# EAGLE design tarjeta2 (EAGLE 6.4)
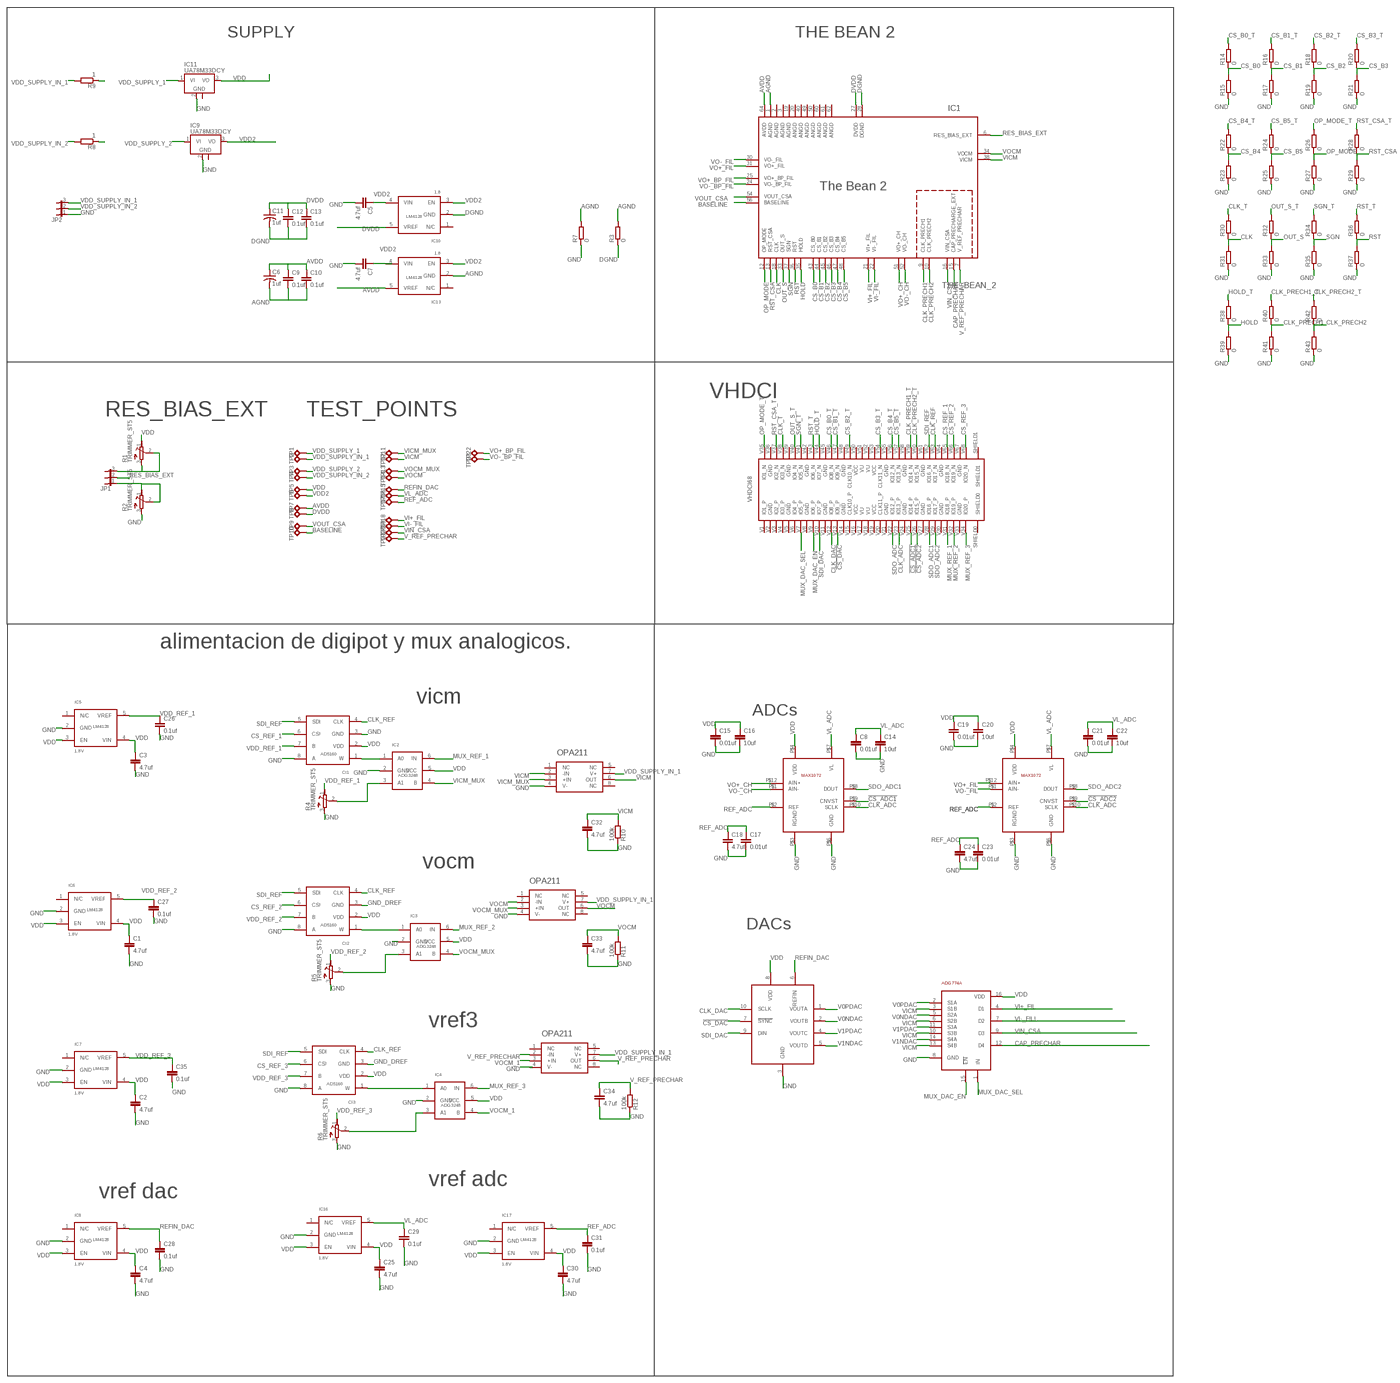
[diagram p0: schematic, sheet 1, overview]
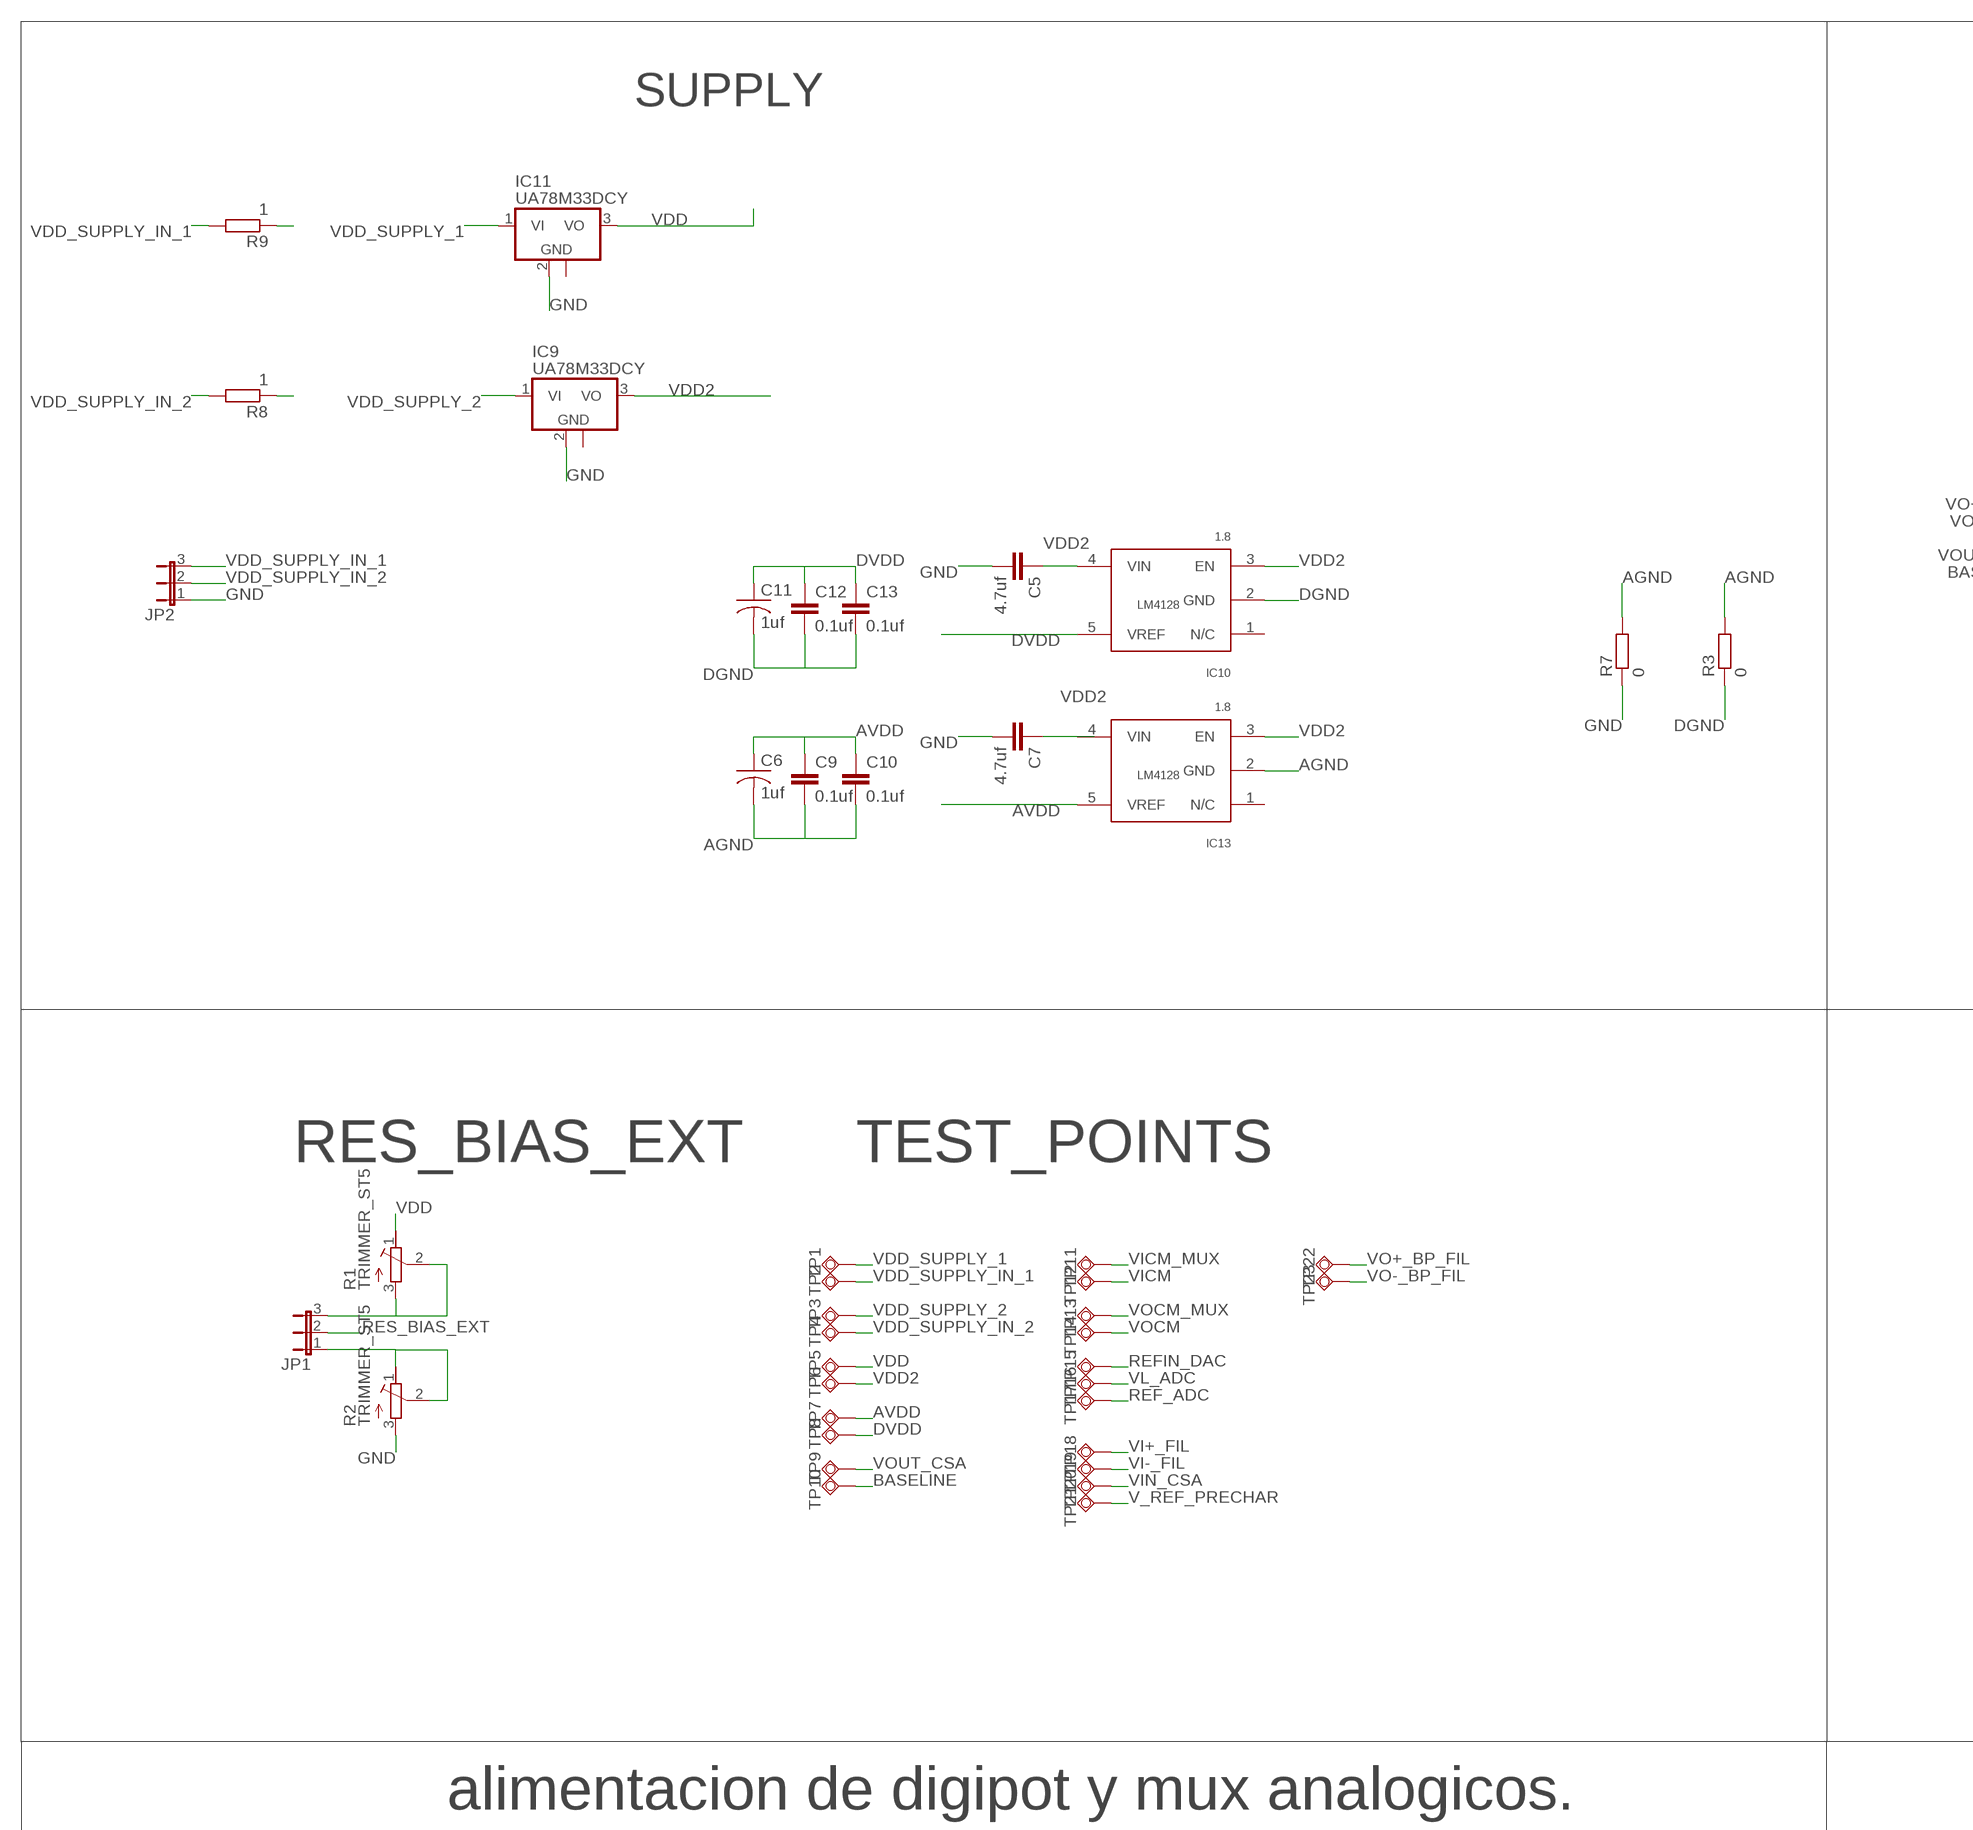
[diagram p1: schematic, sheet 1, part 1 of 4]
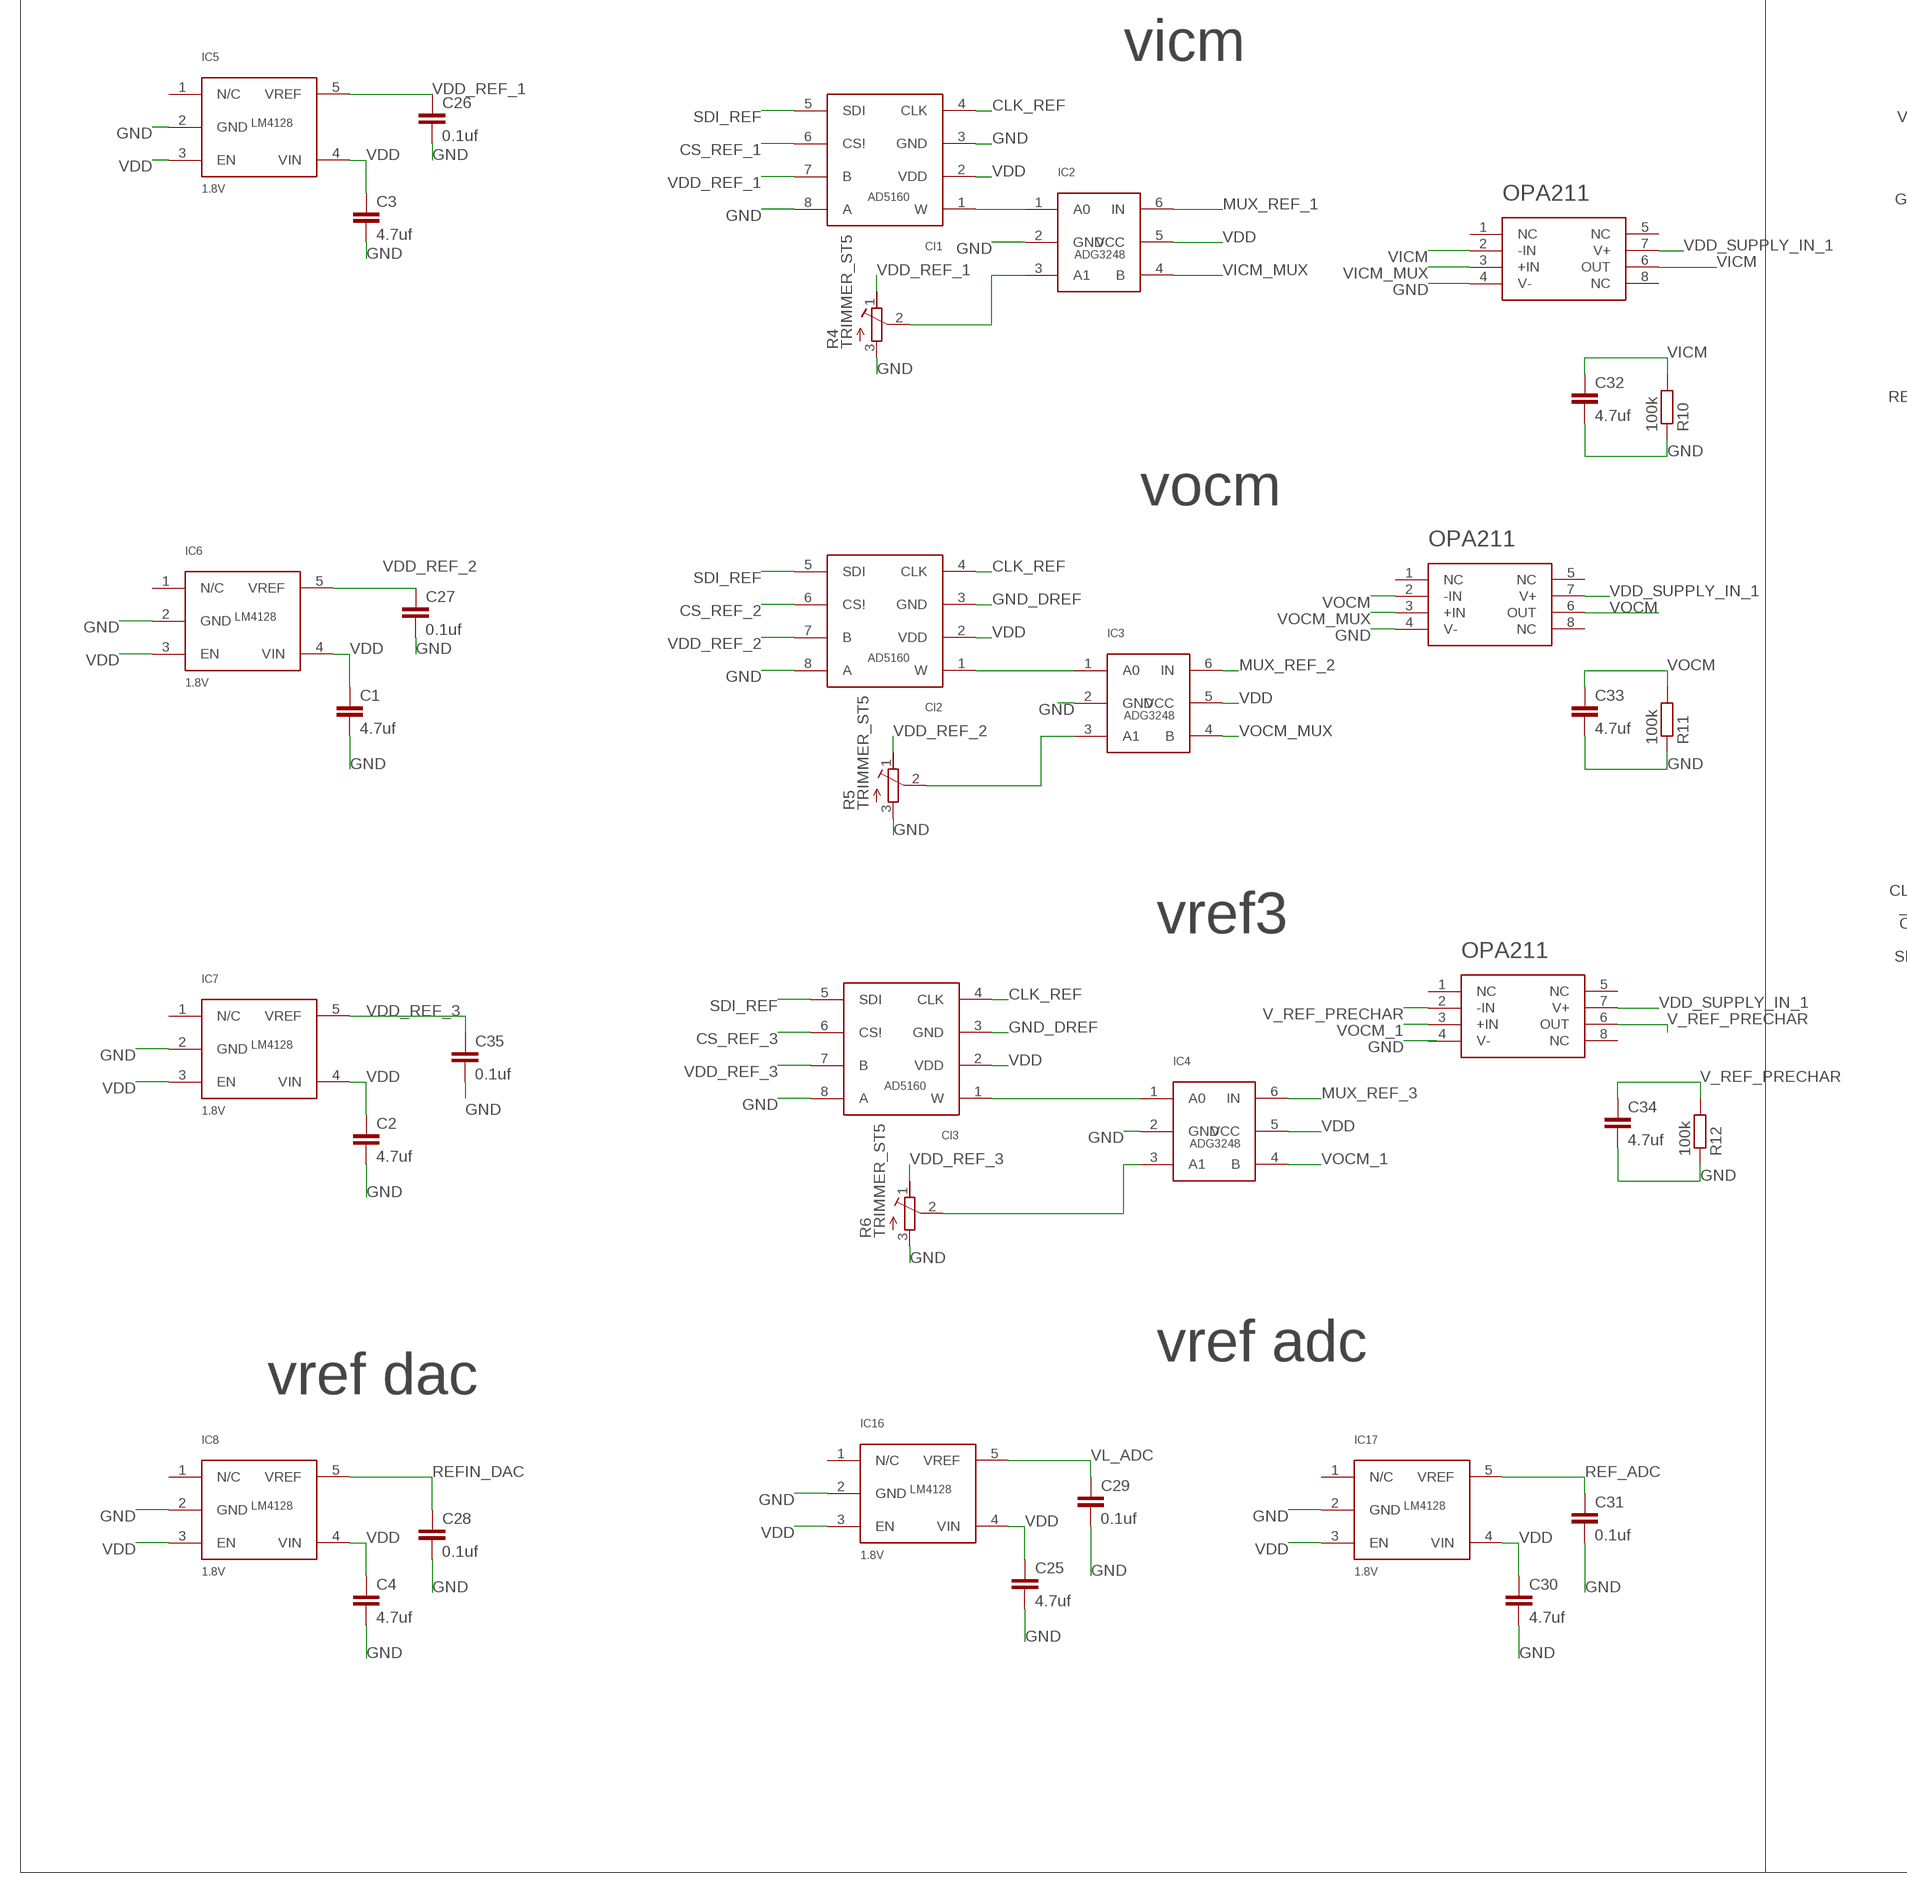
[diagram p2: schematic, sheet 1, part 2 of 4]
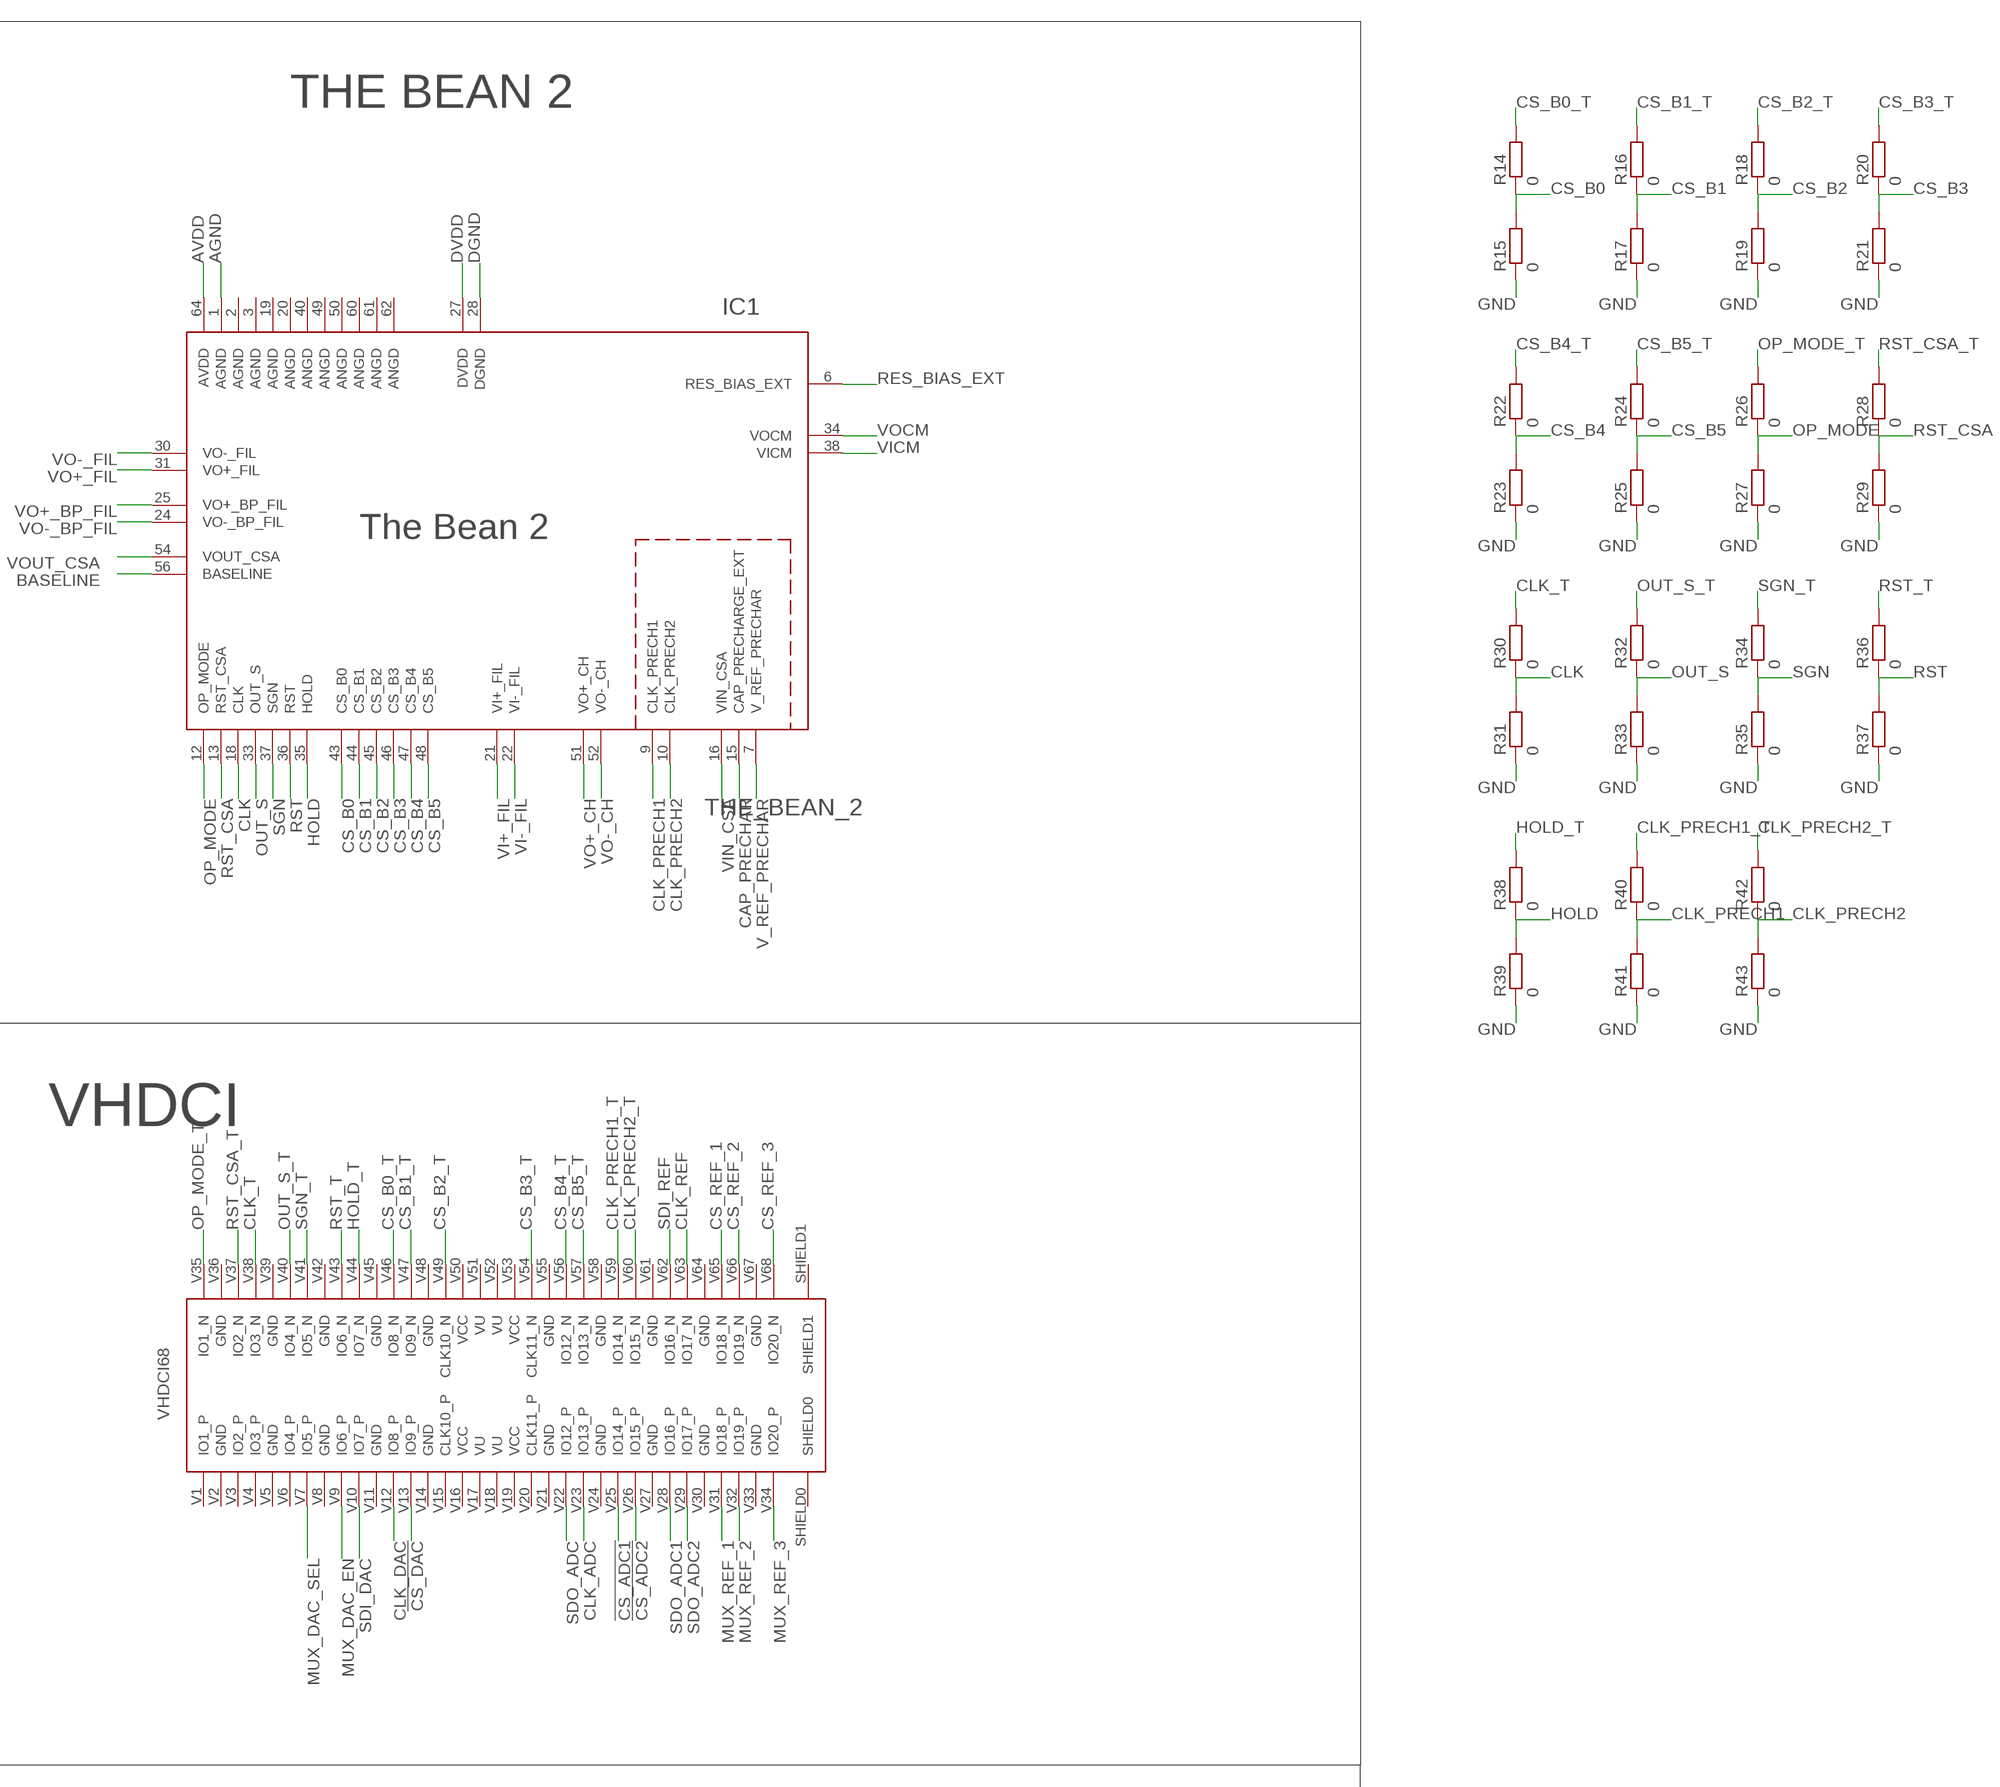
[diagram p3: schematic, sheet 1, part 3 of 4]
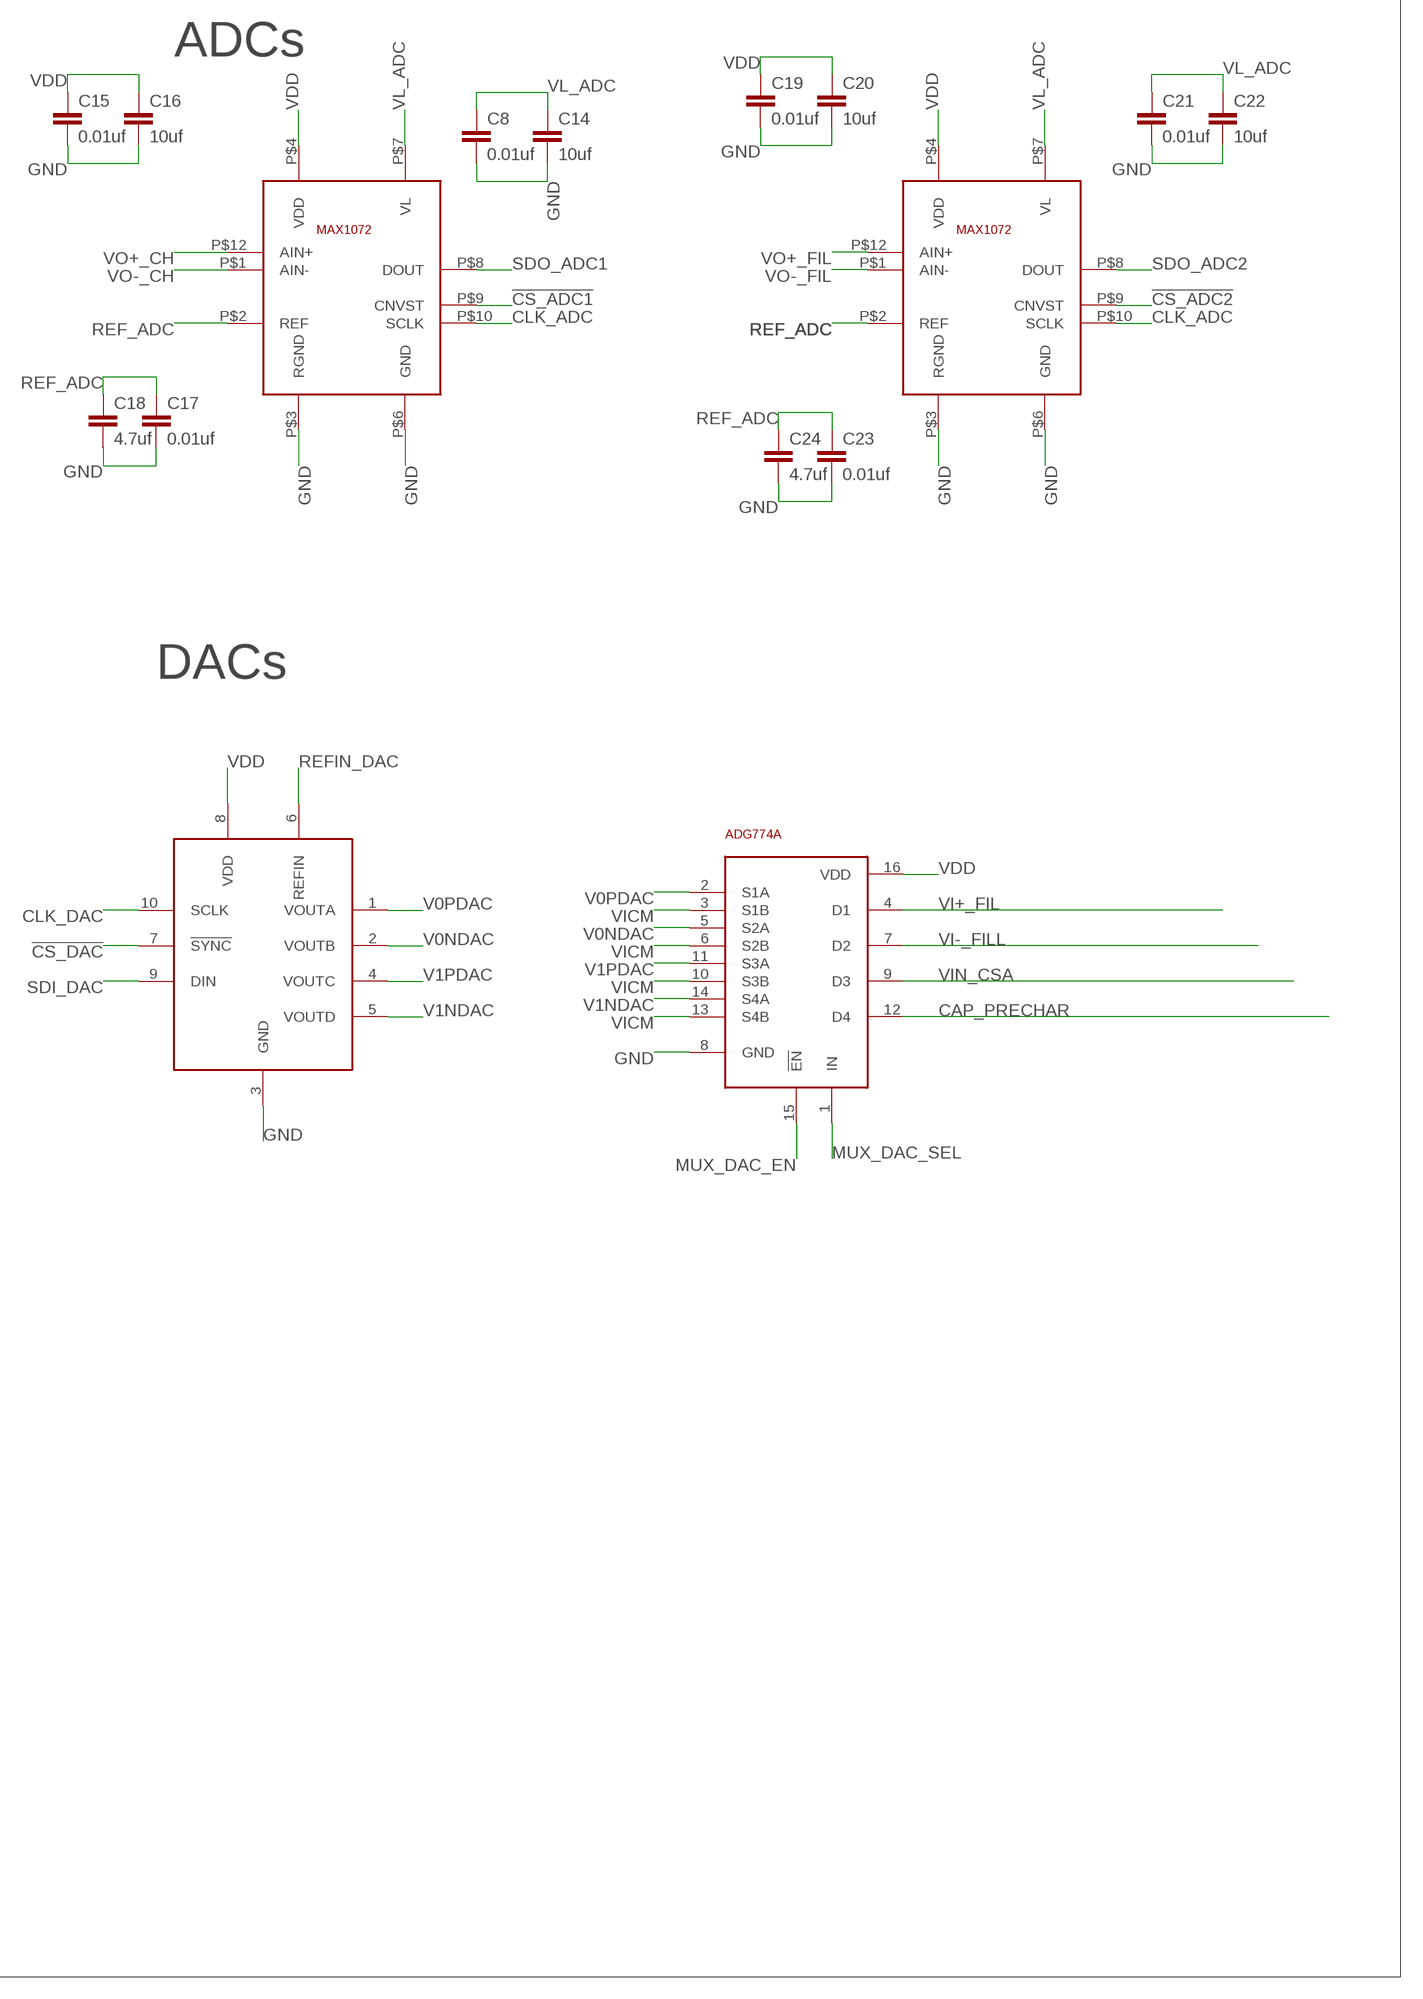
[diagram p4: schematic, sheet 1, part 4 of 4]

## Parts
C1  4.7uf  C-EUC0402  [C0402]
C2  4.7uf  C-EUC0402  [C0402]
C3  4.7uf  C-EUC0402  [C0402]
C4  4.7uf  C-EUC0402  [C0402]
C5  4.7uf  C-EUC0402  [C0402]
C6  1uf  C-USC0805  [C0805]
C7  4.7uf  C-EUC0402  [C0402]
C8  0.01uf  C-EUC0402  [C0402]
C9  0.1uf  C-EUC0402  [C0402]
C10  0.1uf  C-EUC0402  [C0402]
C11  1uf  C-USC0805  [C0805]
C12  0.1uf  C-EUC0402  [C0402]
C13  0.1uf  C-EUC0402  [C0402]
C14  10uf  C-EUC0402  [C0402]
C15  0.01uf  C-EUC0402  [C0402]
C16  10uf  C-EUC0402  [C0402]
C17  0.01uf  C-EUC0402  [C0402]
C18  4.7uf  C-EUC0402  [C0402]
C19  0.01uf  C-EUC0402  [C0402]
C20  10uf  C-EUC0402  [C0402]
C21  0.01uf  C-EUC0402  [C0402]
C22  10uf  C-EUC0402  [C0402]
C23  0.01uf  C-EUC0402  [C0402]
C24  4.7uf  C-EUC0402  [C0402]
C25  4.7uf  C-EUC0402  [C0402]
C26  0.1uf  C-EUC0402  [C0402]
C27  0.1uf  C-EUC0402  [C0402]
C28  0.1uf  C-EUC0402  [C0402]
C29  0.1uf  C-EUC0402  [C0402]
C30  4.7uf  C-EUC0402  [C0402]
C31  0.1uf  C-EUC0402  [C0402]
C32  4.7uf  C-EUC0402  [C0402]
C33  4.7uf  C-EUC0402  [C0402]
C34  4.7uf  C-EUC0402  [C0402]
C35  0.1uf  C-EUC0402  [C0402]
CI1  AD5160  [SOT23-8]
CI2  AD5160  [SOT23-8]
CI3  AD5160  [SOT23-8]
IC1  THE_BEAN_2  [QFN64]
IC2  ADG3248  [SC70]
IC3  ADG3248  [SC70]
IC4  ADG3248  [SC70]
IC5  1.8V  LM4128  [SOT23-5L]
IC6  1.8V  LM4128  [SOT23-5L]
IC7  1.8V  LM4128  [SOT23-5L]
IC8  1.8V  LM4128  [SOT23-5L]
IC9  UA78M33DCY  [SOT223]
IC10  1.8  LM4128  [SOT23-5L]
IC11  UA78M33DCY  [SOT223]
IC12  OPA211  [SOIC8]
IC13  1.8  LM4128  [SOT23-5L]
IC14  OPA211  [SOIC8]
IC15  OPA211  [SOIC8]
IC16  1.8V  LM4128  [SOT23-5L]
IC17  1.8V  LM4128  [SOT23-5L]
JP1  JP2E  [JP2]
JP2  JP2E  [JP2]
R1  TRIMMER_ST5  [ST-5EW]
R2  TRIMMER_ST5  [ST-5EW]
R3  0  R-EU_R0402  [R0402]
R4  TRIMMER_ST5  [ST-5EW]
R5  TRIMMER_ST5  [ST-5EW]
R6  TRIMMER_ST5  [ST-5EW]
R7  0  R-EU_R0402  [R0402]
R8  1  R-EU_R0402  [R0402]
R9  1  R-EU_R0402  [R0402]
R10  100k  R-EU_R0402  [R0402]
R11  100k  R-EU_R0402  [R0402]
R12  100k  R-EU_R0402  [R0402]
R14  0  R-EU_R0402  [R0402]
R15  0  R-EU_R0402  [R0402]
R16  0  R-EU_R0402  [R0402]
R17  0  R-EU_R0402  [R0402]
R18  0  R-EU_R0402  [R0402]
R19  0  R-EU_R0402  [R0402]
R20  0  R-EU_R0402  [R0402]
R21  0  R-EU_R0402  [R0402]
R22  0  R-EU_R0402  [R0402]
R23  0  R-EU_R0402  [R0402]
R24  0  R-EU_R0402  [R0402]
R25  0  R-EU_R0402  [R0402]
R26  0  R-EU_R0402  [R0402]
R27  0  R-EU_R0402  [R0402]
R28  0  R-EU_R0402  [R0402]
R29  0  R-EU_R0402  [R0402]
R30  0  R-EU_R0402  [R0402]
R31  0  R-EU_R0402  [R0402]
R32  0  R-EU_R0402  [R0402]
R33  0  R-EU_R0402  [R0402]
R34  0  R-EU_R0402  [R0402]
R35  0  R-EU_R0402  [R0402]
R36  0  R-EU_R0402  [R0402]
R37  0  R-EU_R0402  [R0402]
R38  0  R-EU_R0402  [R0402]
R39  0  R-EU_R0402  [R0402]
R40  0  R-EU_R0402  [R0402]
R41  0  R-EU_R0402  [R0402]
R42  0  R-EU_R0402  [R0402]
R43  0  R-EU_R0402  [R0402]
TP1  TEST_POINT  [TP]
TP2  TEST_POINT  [TP]
TP3  TEST_POINT  [TP]
TP4  TEST_POINT  [TP]
TP5  TEST_POINT  [TP]
TP6  TEST_POINT  [TP]
TP7  TEST_POINT  [TP]
TP8  TEST_POINT  [TP]
TP9  TEST_POINT  [TP]
TP10  TEST_POINT  [TP]
TP11  TEST_POINT  [TP]
TP12  TEST_POINT  [TP]
TP13  TEST_POINT  [TP]
TP14  TEST_POINT  [TP]
TP15  TEST_POINT  [TP]
TP16  TEST_POINT  [TP]
TP17  TEST_POINT  [TP]
TP18  TEST_POINT  [TP]
TP19  TEST_POINT  [TP]
TP20  TEST_POINT  [TP]
TP21  TEST_POINT  [TP]
TP22  TEST_POINT  [TP]
TP23  TEST_POINT  [TP]
U$1  ADG774A  [QSOP16]
U$2  VHDCI68  [VHDCI68]
U$3  MAX1072  [TQFN12]
U$4  DAC7554  [MSOP10]
U$5  MAX1072  [TQFN12]

## Nets
!CS_ADC1: U$2.V25(IO14_P) U$3.P$9(CNVST)
!CS_ADC2: U$2.V26(IO15_P) U$5.P$9(CNVST)
!CS_DAC: U$2.V13(IO9_P) U$4.7(!SYNC)
AGND: C6.2 C9.2 C10.2 IC1.1(AGND) IC13.2(GND) R3.2 R7.2
AVDD: C6.1 C9.1 C10.1 IC1.64(AVDD) IC13.5(VREF) TP7.TP
BASELINE: IC1.56(BASELINE) TP10.TP
CAP_PRECHAR: IC1.15(CAP_PRECHARGE_EXT) U$1.12(D4)
CLK: IC1.18(CLK) R30.1 R31.2
CLK_ADC: U$2.V23(IO13_P) U$3.P$10(SCLK) U$5.P$10(SCLK)
CLK_DAC: U$2.V12(IO8_P) U$4.10(SCLK)
CLK_PRECH1: IC1.9(CLK_PRECH1) R40.1 R41.2
CLK_PRECH1_T: R40.2 U$2.V59(IO14_N)
CLK_PRECH2: IC1.10(CLK_PRECH2) R42.1 R43.2
CLK_PRECH2_T: R42.2 U$2.V60(IO15_N)
CLK_REF: CI1.4(CLK) CI2.4(CLK) CI3.4(CLK) U$2.V63(IO17_N)
CLK_T: R30.2 U$2.V38(IO3_N)
CS_B0: IC1.43(CS_B0) R14.1 R15.2
CS_B0_T: R14.2 U$2.V46(IO8_N)
CS_B1: IC1.44(CS_B1) R16.1 R17.2
CS_B1_T: R16.2 U$2.V47(IO9_N)
CS_B2: IC1.45(CS_B2) R18.1 R19.2
CS_B2_T: R18.2 U$2.V49(CLK10_N)
CS_B3: IC1.46(CS_B3) R20.1 R21.2
CS_B3_T: R20.2 U$2.V54(CLK11_N)
CS_B4: IC1.47(CS_B4) R22.1 R23.2
CS_B4_T: R22.2 U$2.V56(IO12_N)
CS_B5: IC1.48(CS_B5) R24.1 R25.2
CS_B5_T: R24.2 U$2.V57(IO13_N)
CS_REF_1: CI1.6(CS!) U$2.V65(IO18_N)
CS_REF_2: CI2.6(CS!) U$2.V66(IO19_N)
CS_REF_3: CI3.6(CS!) U$2.V68(IO20_N)
DGND: C11.2 C12.2 C13.2 IC1.28(DGND) IC10.2(GND) R3.1
DVDD: C11.1 C12.1 C13.1 IC1.27(DVDD) IC10.5(VREF) TP8.TP
GND: C1.2 C2.2 C3.2 C4.2 C5.2 C7.2 C8.2 C14.2 C15.2 C16.2 C17.2 C18.2 C19.2 C20.2 C21.2 C22.2 C23.2 C24.2 C25.2 C26.2 C27.2 C28.2 C29.2 C30.2 C31.2 C32.2 C33.2 C34.2 C35.2 CI1.3(GND) CI1.8(A) CI2.8(A) CI3.8(A) IC2.2(GND) IC3.2(GND) IC4.2(GND) IC5.2(GND) IC6.2(GND) IC7.2(GND) IC8.2(GND) IC9.2(GND) IC11.2(GND) IC12.4(V-) IC16.2(GND) IC17.2(GND) JP2.1 R2.3 R4.3 R5.3 R6.3 R7.1 R10.1 R11.1 R12.1 R15.1 R17.1 R19.1 R21.1 R23.1 R25.1 R27.1 R29.1 R31.1 R33.1 R35.1 R37.1 R39.1 R41.1 R43.1 U$1.8(GND) U$3.P$3(RGND) U$3.P$6(GND) U$4.3(GND) U$5.P$3(RGND) U$5.P$6(GND)
GND_DREF: CI2.3(GND) CI3.3(GND)
HOLD: IC1.35(HOLD) R38.1 R39.2
HOLD_T: R38.2 U$2.V44(IO7_N)
MUX_DAC_EN: U$1.15(!EN) U$2.V9(IO6_P)
MUX_DAC_SEL: U$1.1(IN) U$2.V7(IO5_P)
MUX_REF_1: IC2.6(IN) U$2.V31(IO18_P)
MUX_REF_2: IC3.6(IN) U$2.V32(IO19_P)
MUX_REF_3: IC4.6(IN) U$2.V34(IO20_P)
N$1: JP1.3 R1.2 R1.3
N$2: JP1.1 R2.1 R2.2
N$5: CI3.1(W) IC4.1(A0)
N$10: IC4.3(A1) R6.2
N$17: CI1.1(W) IC2.1(A0)
N$18: IC2.3(A1) R4.2
N$19: CI2.1(W) IC3.1(A0)
N$28: IC3.3(A1) R5.2
OP_MODE: IC1.12(OP_MODE) R26.1 R27.2
OP_MODE_T: R26.2 U$2.V35(IO1_N)
OUT_S: IC1.33(OUT_S) R32.1 R33.2
OUT_S_T: R32.2 U$2.V40(IO4_N)
REF_ADC: C17.1 C18.1 C23.1 C24.1 C31.1 IC17.5(VREF) TP17.TP U$3.P$2(REF) U$5.P$2(REF)
REFIN_DAC: IC8.5(VREF) TP15.TP U$4.6(REFIN)
RES_BIAS_EXT: IC1.6(RES_BIAS_EXT) JP1.2
RST: IC1.36(RST) R36.1 R37.2
RST_CSA: IC1.13(RST_CSA) R28.1 R29.2
RST_CSA_T: R28.2 U$2.V37(IO2_N)
RST_T: R36.2 U$2.V43(IO6_N)
SDI_DAC: U$2.V10(IO7_P) U$4.9(DIN)
SDI_REF: CI1.5(SDI) CI2.5(SDI) CI3.5(SDI) U$2.V62(IO16_N)
SDO_ADC: U$2.V22(IO12_P)
SDO_ADC1: U$2.V28(IO16_P) U$3.P$8(DOUT)
SDO_ADC2: U$2.V29(IO17_P) U$5.P$8(DOUT)
SGN: IC1.37(SGN) R34.1 R35.2
SGN_T: R34.2 U$2.V41(IO5_N)
V0NDAC: U$1.5(S2A) U$4.2(VOUTB)
V0PDAC: U$1.2(S1A) U$4.1(VOUTA)
V1NDAC: U$1.14(S4A) U$4.5(VOUTD)
V1PDAC: U$1.11(S3A) U$4.4(VOUTC)
V_REF_PRECHAR: C34.1 IC1.7(V_REF_PRECHAR) IC15.2(-IN) IC15.6(OUT) R12.2 TP21.TP
VDD: C1.1 C2.1 C3.1 C4.1 C15.1 C16.1 C19.1 C20.1 C25.1 C30.1 CI1.2(VDD) CI2.2(VDD) CI3.2(VDD) IC2.5(VCC) IC3.5(VCC) IC4.5(VCC) IC5.3(EN) IC5.4(VIN) IC6.3(EN) IC6.4(VIN) IC7.3(EN) IC7.4(VIN) IC8.3(EN) IC8.4(VIN) IC11.3(VO) IC16.3(EN) IC16.4(VIN) IC17.3(EN) IC17.4(VIN) R1.1 TP5.TP U$1.16(VDD) U$3.P$4(VDD) U$4.8(VDD) U$5.P$4(VDD)
VDD1: C28.1
VDD2: C5.1 C7.1 IC9.3(VO) IC10.3(EN) IC10.4(VIN) IC13.3(EN) IC13.4(VIN) TP6.TP
VDD_REF_1: C26.1 CI1.7(B) IC5.5(VREF) R4.1
VDD_REF_2: C27.1 CI2.7(B) IC6.5(VREF) R5.1
VDD_REF_3: C35.1 CI3.7(B) IC7.5(VREF) R6.1
VDD_SUPPLY_1: IC11.1(VI) R9.1 TP1.TP
VDD_SUPPLY_2: IC9.1(VI) R8.1 TP3.TP
VDD_SUPPLY_IN_1: IC12.7(V+) IC14.7(V+) IC15.7(V+) JP2.3 R9.2 TP2.TP
VDD_SUPPLY_IN_2: JP2.2 R8.2 TP4.TP
VI+_FIL: IC1.21(VI+_FIL) TP18.TP U$1.4(D1)
VI-_FIL: IC1.22(VI-_FIL) TP19.TP
VI-_FILL: U$1.7(D2)
VICM: C32.1 IC1.38(VICM) IC12.2(-IN) IC12.6(OUT) R10.2 TP12.TP U$1.3(S1B) U$1.6(S2B) U$1.10(S3B) U$1.13(S4B)
VICM_MUX: IC2.4(B) IC12.3(+IN) TP11.TP
VIN_CSA: IC1.16(VIN_CSA) TP20.TP U$1.9(D3)
VL_ADC: C8.1 C14.1 C21.1 C22.1 C29.1 IC16.5(VREF) TP16.TP U$3.P$7(VL) U$5.P$7(VL)
VO+_BP_FIL: IC1.25(VO+_BP_FIL) TP22.TP
VO+_CH: IC1.51(VO+_CH) U$3.P$12(AIN+)
VO+_FIL: IC1.31(VO+_FIL) U$5.P$12(AIN+)
VO-_BP_FIL: IC1.24(VO-_BP_FIL) TP23.TP
VO-_CH: IC1.52(VO-_CH) U$3.P$1(AIN-)
VO-_FIL: IC1.30(VO-_FIL) U$5.P$1(AIN-)
VOCM: C33.1 IC1.34(VOCM) IC14.2(-IN) IC14.6(OUT) R11.2 TP14.TP
VOCM_1: IC4.4(B) IC15.3(+IN)
VOCM_MUX: IC3.4(B) IC14.3(+IN) TP13.TP
VOUT_CSA: IC1.54(VOUT_CSA) TP9.TP
Unconnected: IC5.1(N/C) IC6.1(N/C) IC7.1(N/C) IC8.1(N/C) IC9.4(GND) IC10.1(N/C) IC11.4(GND) IC12.1(NC) IC12.5(NC) IC12.8(NC) IC13.1(N/C) IC14.1(NC) IC14.4(V-) IC14.5(NC) IC14.8(NC) IC15.1(NC) IC15.4(V-) IC15.5(NC) IC15.8(NC) IC16.1(N/C) IC17.1(N/C) U$2.SHIELD0 U$2.SHIELD1 U$2.V1(IO1_P) U$2.V2(GND) U$2.V3(IO2_P) U$2.V4(IO3_P) U$2.V5(GND) U$2.V6(IO4_P) U$2.V8(GND) U$2.V11(GND) U$2.V14(GND) U$2.V15(CLK10_P) U$2.V20(CLK11_P) U$2.V21(GND) U$2.V24(GND) U$2.V27(GND) U$2.V30(GND) U$2.V33(GND) U$2.V36(GND) U$2.V39(GND) U$2.V42(GND) U$2.V45(GND) U$2.V48(GND) U$2.V55(GND) U$2.V58(GND) U$2.V61(GND) U$2.V64(GND) U$2.V67(GND)

## Notes on the sheet
- SUPPLY | THE BEAN 2
- VHDCI
- RES_BIAS_EXT | TEST_POINTS
- alimentacion de digipot y mux analogicos.
- vicm
- ADCs
- vocm
- DACs
- vref3
- vref adc
- vref dac

## Power pins joined to a net without a drawn wire
AGND: IC1.2(AGND) IC1.3(AGND) IC1.19(AGND)
ANGD: IC1.20(ANGD) IC1.40(ANGD) IC1.49(ANGD) IC1.50(ANGD) IC1.60(ANGD) IC1.61(ANGD) IC1.62(ANGD)
VCC: U$2.V16(VCC) U$2.V19(VCC) U$2.V50(VCC) U$2.V53(VCC)
VU: U$2.V17(VU) U$2.V18(VU) U$2.V51(VU) U$2.V52(VU)

## Library data of the parts
C1-C5 C7-C10 C12-C35 = rcl:C-EU: CAPACITOR, European symbol
C6 C11 = rcl:C-US: CAPACITOR, American symbol
CI1-CI3 = wac:AD5160: Digital potenciometer, package SOT23-8
IC1 = wac:THE_BEAN_2
IC2-IC4 = wac:ADG3248
IC5-IC8 IC10 IC13 IC16 IC17 = wac:LM4128
IC9 IC11 = linear:UA78M*: POSITIVE-VOLTAGE REGULATORS Source: http://focus.ti.com/lit/ds/symlink/ua78m33.pdf
IC12 IC14 IC15 = wac:OPA211
JP1 JP2 = jumper:JP2E: JUMPER
R1 R2 R4-R6 = wac:TRIMMER_ST5
R3 R7-R12 R14-R43 = rcl:R-EU_: RESISTOR, European symbol
TP1-TP23 = wac:TEST_POINT
U$1 = wac:ADG774A: Low voltage,400MHz, Quad 2:1 MUX with 3ns Switching Time http://www.analog.com/static/imported-files/data_sheets/ADG774A.pdf
U$2 = tw:VHDCI68: Nexys 3 VHDCI 68pin 0.8mm pitch
U$3 U$5 = wac:MAX1072
U$4 = wac:DAC7554: 12-BIT, QUAD, ULTRALOW GLITCH, VOLTAGE OUTPUT DIGITAL-TO-ANALOG CONVERTER http://www.ti.com/lit/ds/symlink/dac7554.pdf

## Board
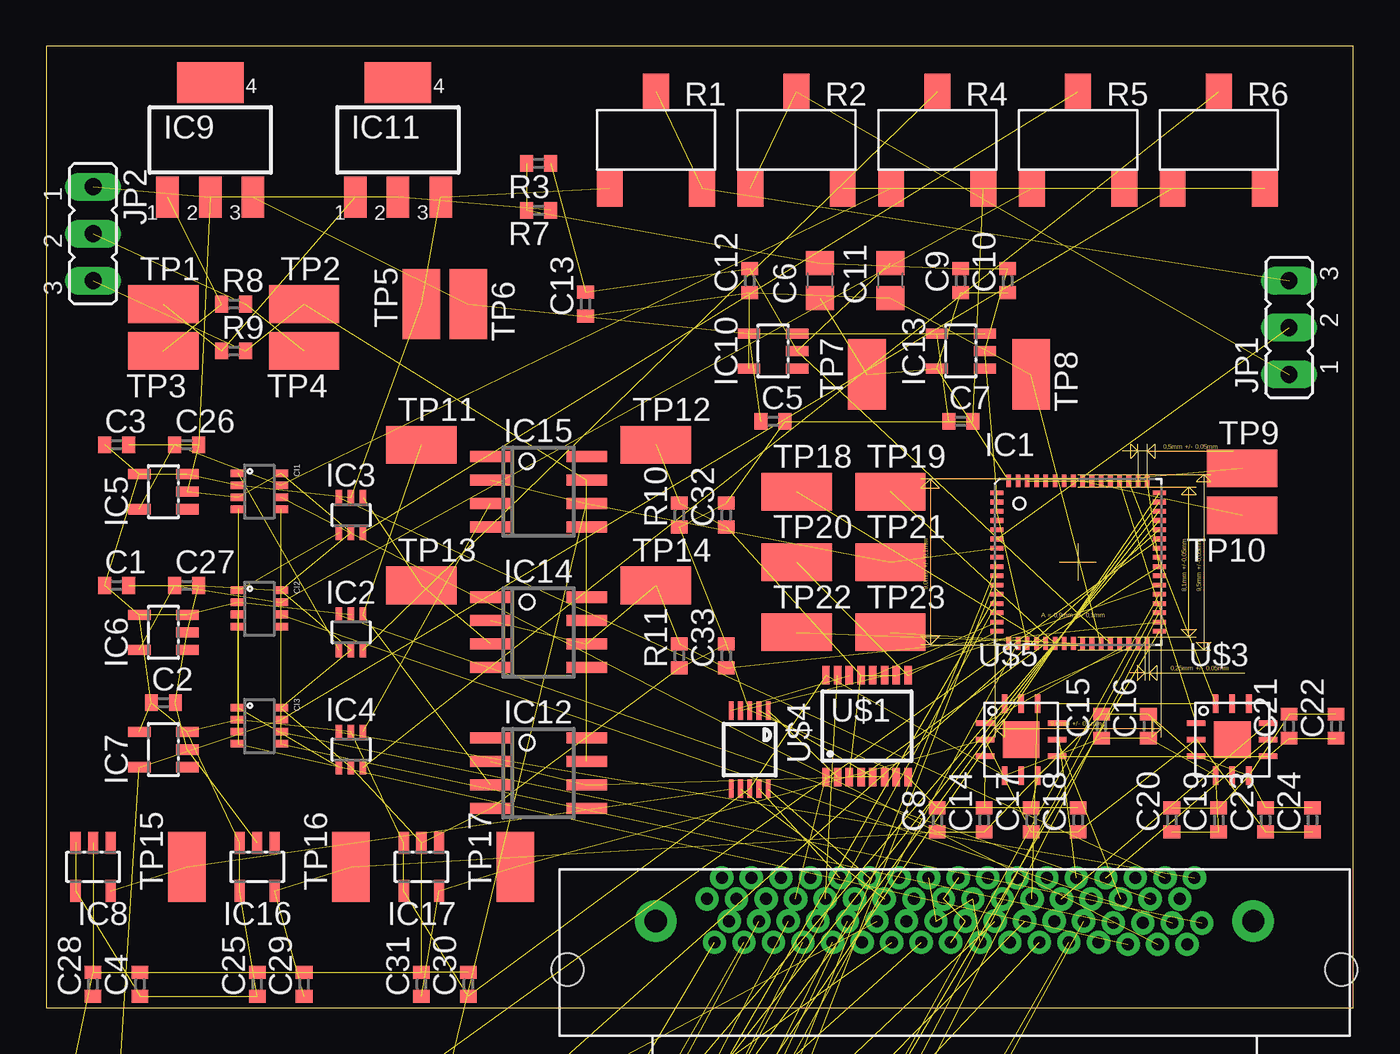
[diagram p5: board, top side]
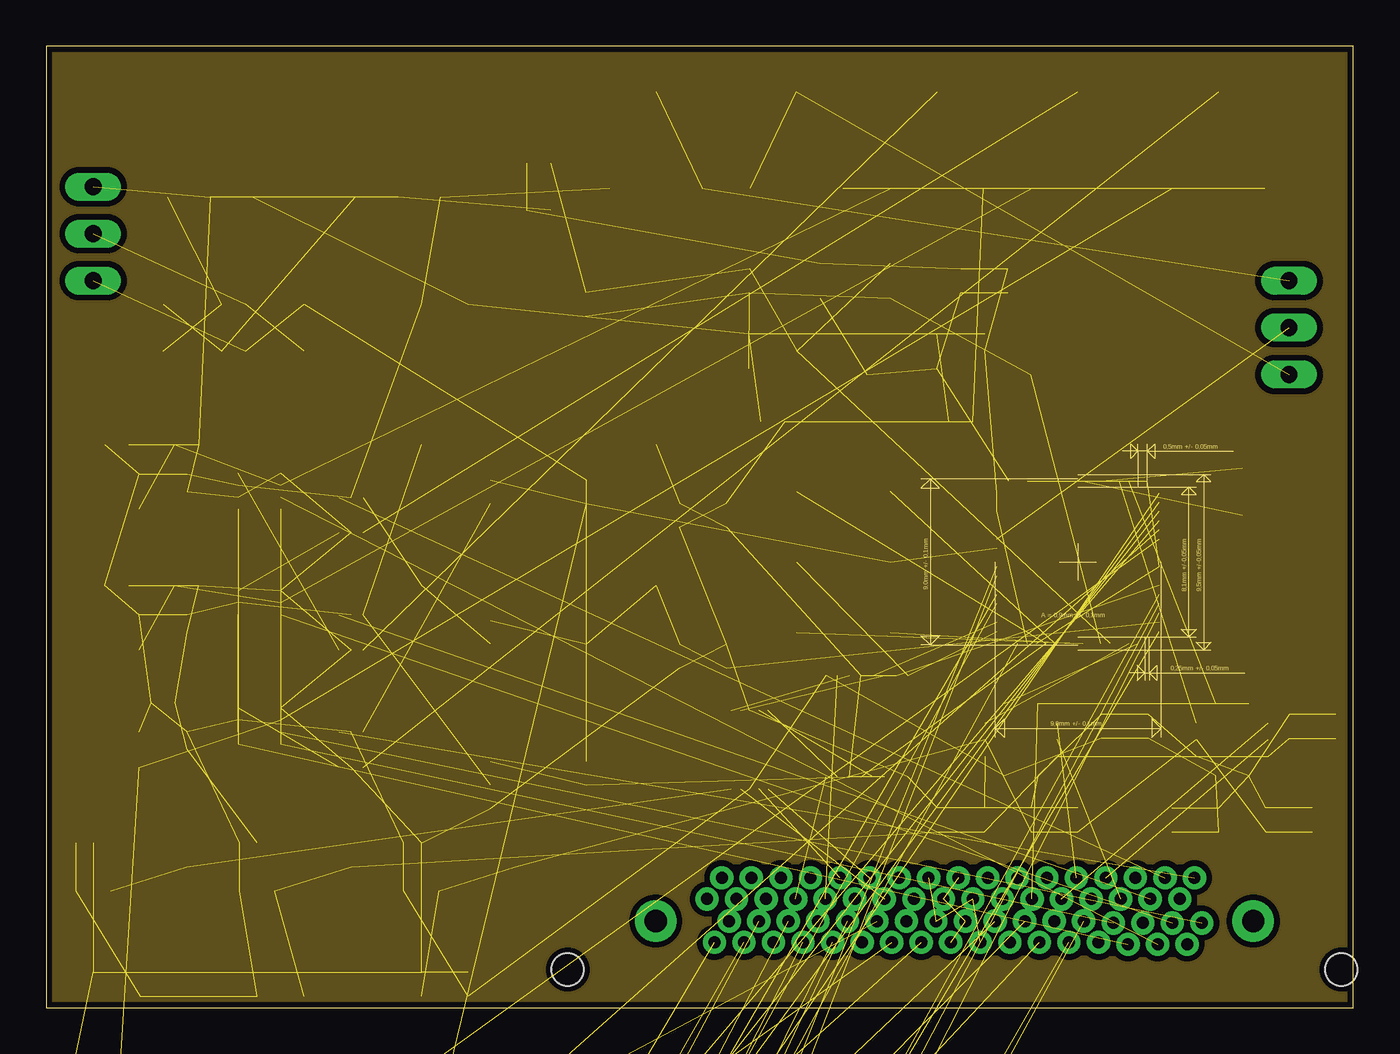
[diagram p6: board, inner layer Route2]
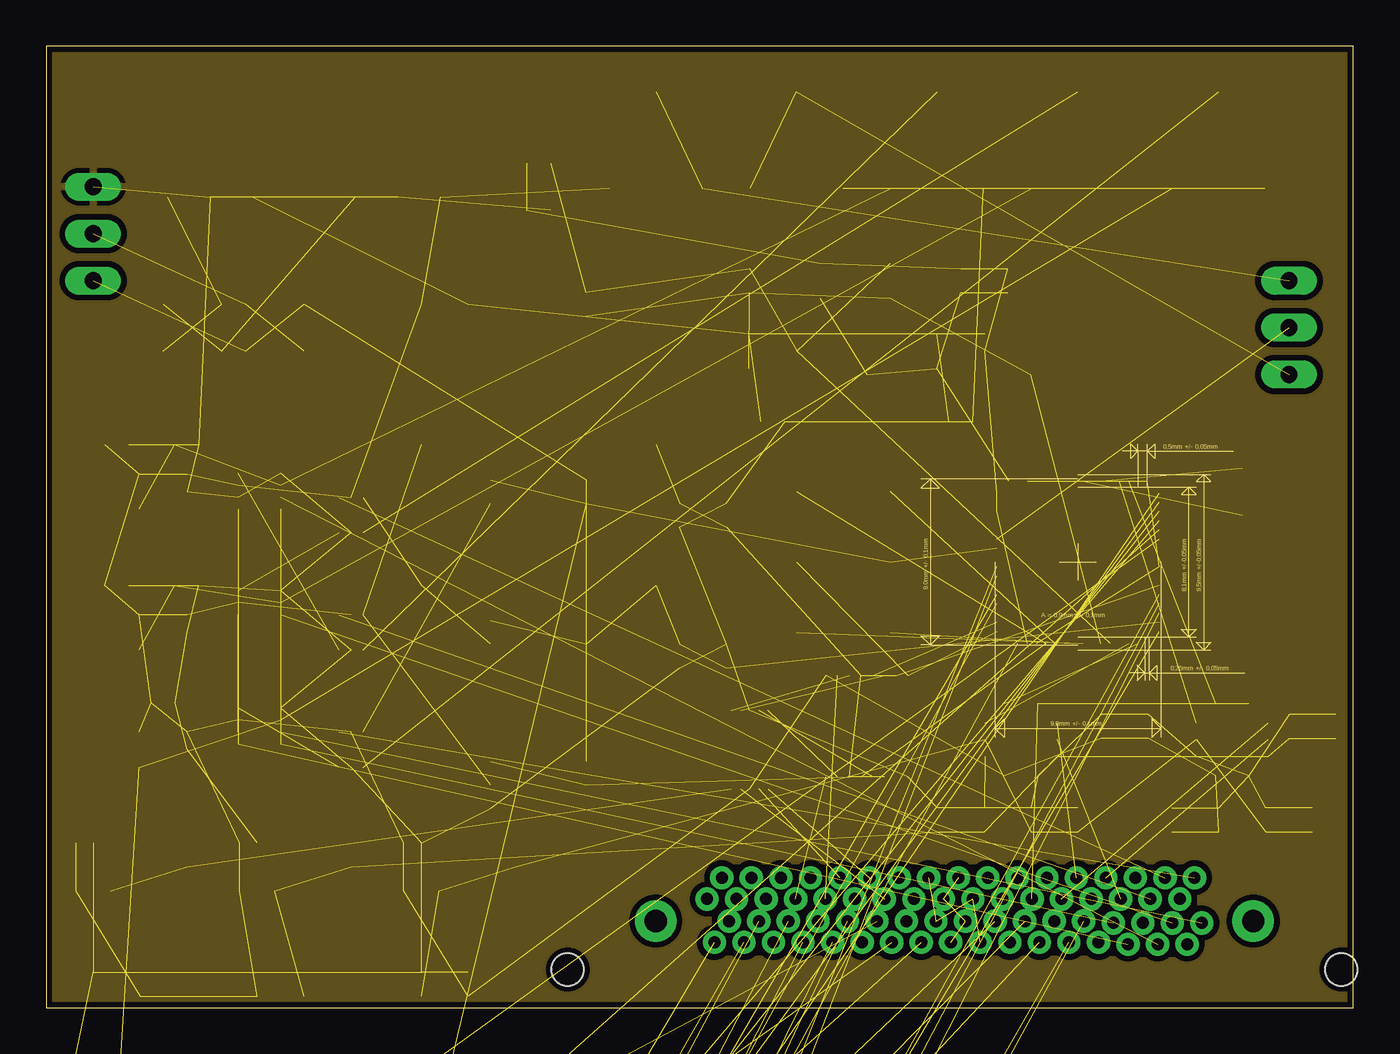
[diagram p7: board, inner layer Route3]

Size 70.79 x 52.07 mm. Coordinates in mm from the lower left corner, seen from the top.
Outline: 0,0 70.79,0 70.79,52.06 0.01,52.07 0,0
Copper layers [2:(1*2*3*4):3]: Top 0.035mm / dielectric 0.2mm / Route2 0.035mm / dielectric 0.15mm / Route3 0.035mm / dielectric 0.2mm / Route4 0.035mm
Design rules "SparkFun *": minimum track width 8mil, minimum drill 20mil, track to track 8mil, track to pad 8mil, pad to pad 8mil, via to via 8mil, smd to smd 8mil, copper to edge 10mil, drill to drill 8mil, minimum pad ring 12mil, minimum via ring 10mil, stop-mask expansion 4mil, vias tented up to drill 25mil, thermal gap 10mil

### Footprints (pad centres in the part's own frame; a part is rotated, then mirrored left to right if it is on the bottom)
C0402 = smd 0.7 x 0.9: 1 -0.65,0; 2 0.65,0
C0805 = smd 1.3 x 1.5: 1 -0.95,0; 2 0.95,0
SOT23-8 = smd 0.406 x 0.813: 1 -1,1.5; 2 -0.35,1.5; 3 0.3,1.5; 4 0.95,1.5; 5 0.95,3.8; 6 0.3,3.8; 7 -0.35,3.8; 8 -1,3.8
QFN64 = smd 0.7 x 0.25: 1 -14.56,5.02; 2 -14.56,4.52; 3 -14.56,4.02; 4 -14.56,3.52; 5 -14.56,3.02; 6 -14.56,2.52; 7 -14.56,2.02; 8 -14.56,1.52; 9 -14.56,1.02; 10 -14.56,0.52; 11 -14.56,0.02; 12 -14.56,-0.48; 13 -14.56,-0.98; 14 -14.56,-1.48; 15 -14.56,-1.98; 16 -14.56,-2.48; 33 -5.76,-2.48; 34 -5.76,-1.98; 35 -5.76,-1.48; 36 -5.76,-0.98; 37 -5.76,-0.48; 38 -5.76,0.02; 39 -5.76,0.52; 40 -5.76,1.02; 41 -5.76,1.52; 42 -5.76,2.02; 43 -5.76,2.52; 44 -5.76,3.02; 45 -5.76,3.52; 46 -5.76,4.02; 47 -5.76,4.52; 48 -5.76,5.02 | smd 0.25 x 0.7: 17 -13.91,-3.13; 18 -13.41,-3.13; 19 -12.91,-3.13; 20 -12.41,-3.13; 21 -11.91,-3.13; 22 -11.41,-3.13; 23 -10.91,-3.13; 24 -10.41,-3.13; 25 -9.91,-3.13; 26 -9.41,-3.13; 27 -8.91,-3.13; 28 -8.41,-3.13; 29 -7.91,-3.13; 30 -7.41,-3.13; 31 -6.91,-3.13; 32 -6.41,-3.13; 49 -6.41,5.67; 50 -6.91,5.67; 51 -7.41,5.67; 52 -7.91,5.67; 53 -8.41,5.67; 54 -8.91,5.67; 55 -9.41,5.67; 56 -9.91,5.67; 57 -10.41,5.67; 58 -10.91,5.67; 59 -11.41,5.67; 60 -11.91,5.67; 61 -12.41,5.67; 62 -12.91,5.67; 63 -13.41,5.67; 64 -13.91,5.67
SC70 = smd 0.35 x 0.8: 1 -0.65,-0.95; 2 0,-0.95; 3 0.65,-0.95; 4 0.65,0.95; 5 0,0.95; 6 -0.65,0.95
SOT23-5L = smd 0.55 x 1.2: 1 -0.95,-1.3; 2 0,-1.3; 3 0.95,-1.3; 4 0.95,1.3; 5 -0.95,1.3
SOT223 = smd 1.219 x 2.235: 1 -2.311,-3.099; 2 0,-3.099; 3 2.311,-3.099 | smd 3.6 x 2.2: 4 0,3.099
SOIC8 = smd 0.6 x 2.2: 1 -1.905,-2.6; 2 -0.635,-2.6; 3 0.635,-2.6; 4 1.905,-2.6; 5 1.905,2.6; 6 0.635,2.6; 7 -0.635,2.6; 8 -1.905,2.6
JP2 = drill 0.914 long: 1 -2.54,0; 2 0,0; 3 2.54,0
ST-5EW = smd 1.4 x 2: 1 -2.5,-2.6; 2 0,2.6; 3 2.5,-2.6
R0402 = smd 0.7 x 0.9: 1 -0.65,0; 2 0.65,0
TP = smd 3.81 x 2.032: TP 0,0
QSOP16 = smd 0.4 x 1: 1 -2.223,-2.75; 2 -1.588,-2.75; 3 -0.953,-2.75; 4 -0.318,-2.75; 5 0.318,-2.75; 6 0.953,-2.75; 7 1.588,-2.75; 8 2.223,-2.75; 9 2.223,2.75; 10 1.588,2.75; 11 0.953,2.75; 12 0.318,2.75; 13 -0.318,2.75; 14 -0.953,2.75; 15 -1.588,2.75; 16 -2.223,2.75
VHDCI68 = drill 1.2 pad 2.25: SHIELD0 18.375,-0.4; SHIELD1 -13.975,-0.4 | drill 0.65 pad 1: V1 -11.2,0.8; V2 -10.4,1.95; V3 -9.6,0.8; V4 -8.8,1.95; V5 -8,0.8; V6 -7.2,1.95; V7 -6.4,0.8; V8 -5.6,1.95; V9 -4.8,0.8; V10 -4,1.95; V11 -3.2,0.8; V12 -2.4,1.95; V13 -1.6,0.8; V14 -0.8,1.95; V15 0,0.8; V16 0.8,1.95; V17 1.6,0.8; V18 2.4,1.95; V19 3.2,0.8; V20 4,1.95; V21 4.8,0.8; V22 5.6,1.95; V23 6.4,0.8; V24 7.2,1.95; V25 8,0.8; V26 8.8,1.95; V27 9.6,0.8; V28 10.4,1.95; V29 11.2,0.8; V30 12,1.95; V31 12.8,0.8; V32 13.6,1.95; V33 14.4,0.8; V34 15.2,1.95; V35 -10.8,-1.55; V36 -10,-0.4; V37 -9.2,-1.55; V38 -8.4,-0.4; V39 -7.6,-1.55; V40 -6.8,-0.4; V41 -6,-1.55; V42 -5.2,-0.4; V43 -4.4,-1.55; V44 -3.6,-0.4; V45 -2.8,-1.55; V46 -2,-0.4; V47 -1.2,-1.55; V48 -0.4,-0.4; V49 0.4,-1.55; V50 1.2,-0.4; V51 2,-1.55; V52 2.8,-0.4; V53 3.6,-1.55; V54 4.4,-0.4; V55 5.2,-1.55; V56 6,-0.4; V57 6.8,-1.55; V58 7.6,-0.4; V59 8.4,-1.55; V60 9.2,-0.4; V61 10,-1.55; V62 10.8,-0.5; V63 11.6,-1.65; V64 12.4,-0.5; V65 13.2,-1.65; V66 14,-0.5; V67 14.8,-1.65; V68 15.6,-0.5 | hole 1.75: -18.75,-3.025; 23.15,-3.025
TQFN12 = smd 1 x 0.3: P$1 0.05,-1.1; P$2 0.05,-2; P$3 0.05,-2.9; P$7 3.95,-2.9; P$8 3.95,-2; P$9 3.95,-1.1 | smd 0.3 x 1: P$4 1.1,-3.95; P$5 2,-3.95; P$6 2.9,-3.95; P$10 2.9,-0.05; P$11 2,-0.05; P$12 1.1,-0.05 | smd 2 x 2: P$13 2,-2
MSOP10 = smd 0.25 x 1: 1 -1,-2.113; 2 -0.5,-2.113; 3 0,-2.113; 4 0.5,-2.113; 5 1,-2.113; 6 1,2.113; 7 0.5,2.113; 8 0,2.113; 9 -0.5,2.113; 10 -1,2.113

### Placement (x,y rotation side)
C1  3.81,22.86 0 top
C2  6.35,16.51 0 top
C3  3.81,30.48 0 top
C4  5.08,1.27 90 top
C5  39.37,31.75 0 top
C6  41.91,39.37 90 top
C7  49.53,31.75 0 top
C8  48.26,10.16 90 top
C9  49.53,39.37 90 top
C10  52.07,39.37 90 top
C11  45.72,39.37 90 top
C12  38.1,39.37 90 top
C13  29.21,38.1 90 top
C14  50.8,10.16 90 top
C15  57.15,15.24 90 top
C16  59.69,15.24 90 top
C17  53.34,10.16 90 top
C18  55.88,10.16 90 top
C19  63.5,10.16 90 top
C20  60.96,10.16 90 top
C21  67.31,15.24 90 top
C22  69.85,15.24 90 top
C23  66.04,10.16 90 top
C24  68.58,10.16 90 top
C25  11.43,1.27 90 top
C26  7.62,30.48 0 top
C27  7.62,22.86 0 top
C28  2.54,1.27 90 top
C29  13.97,1.27 90 top
C30  22.86,1.27 90 top
C31  20.32,1.27 90 top
C32  36.83,26.67 90 top
C33  36.83,19.05 90 top
C34  -2.54,-106.68 0 top  (outside the outline)
C35  -2.54,-116.84 0 top  (outside the outline)
CI1  8.89,27.94 270 top
CI2  8.89,21.59 270 top
CI3  8.89,15.24 270 top
IC1  66.04,22.86 0 top
IC2  16.51,20.32 0 top
IC3  16.51,26.67 0 top
IC4  16.51,13.97 0 top
IC5  6.35,27.94 90 top
IC6  6.35,20.32 90 top
IC7  6.35,13.97 90 top
IC8  2.54,7.62 180 top
IC9  8.89,46.99 0 top
IC10  39.37,35.56 90 top
IC11  19.05,46.99 0 top
IC12  26.67,12.7 270 top
IC13  49.53,35.56 90 top
IC14  26.67,20.32 270 top
IC15  26.67,27.94 270 top
IC16  11.43,7.62 180 top
IC17  20.32,7.62 180 top
JP1  67.31,36.83 90 top
JP2  2.54,41.91 270 top
R1  33.02,46.99 0 top
R2  40.64,46.99 0 top
R3  26.67,45.72 180 top
R4  48.26,46.99 0 top
R5  55.88,46.99 0 top
R6  63.5,46.99 0 top
R7  26.67,43.18 180 top
R8  10.16,38.1 0 top
R9  10.16,35.56 0 top
R10  34.29,26.67 90 top
R11  34.29,19.05 90 top
R12  -2.54,-111.76 0 top  (outside the outline)
R14  -2.54,-20.32 0 top  (outside the outline)
R15  -2.54,-25.4 0 top  (outside the outline)
R16  -2.54,-30.48 0 top  (outside the outline)
R17  -2.54,-35.56 0 top  (outside the outline)
R18  -2.54,-40.64 0 top  (outside the outline)
R19  2.54,-40.64 0 top  (outside the outline)
R20  -2.54,-45.72 0 top  (outside the outline)
R21  2.54,-45.72 0 top  (outside the outline)
R22  -2.54,-50.8 0 top  (outside the outline)
R23  2.54,-50.8 0 top  (outside the outline)
R24  -2.54,-55.88 0 top  (outside the outline)
R25  2.54,-55.88 0 top  (outside the outline)
R26  -2.54,-60.96 0 top  (outside the outline)
R27  2.54,-60.96 0 top  (outside the outline)
R28  -2.54,-66.04 0 top  (outside the outline)
R29  2.54,-66.04 0 top  (outside the outline)
R30  -2.54,-71.12 0 top  (outside the outline)
R31  2.54,-71.12 0 top  (outside the outline)
R32  -2.54,-76.2 0 top  (outside the outline)
R33  2.54,-76.2 0 top  (outside the outline)
R34  -2.54,-81.28 0 top  (outside the outline)
R35  2.54,-81.28 0 top  (outside the outline)
R36  -2.54,-86.36 0 top  (outside the outline)
R37  2.54,-86.36 0 top  (outside the outline)
R38  -2.54,-91.44 0 top  (outside the outline)
R39  2.54,-91.44 0 top  (outside the outline)
R40  -2.54,-96.52 0 top  (outside the outline)
R41  2.54,-96.52 0 top  (outside the outline)
R42  -2.54,-101.6 0 top  (outside the outline)
R43  2.54,-101.6 0 top  (outside the outline)
TP1  6.35,38.1 0 top
TP2  13.97,38.1 0 top
TP3  6.35,35.56 180 top
TP4  13.97,35.56 180 top
TP5  20.32,38.1 90 top
TP6  22.86,38.1 270 top
TP7  44.45,34.29 90 top
TP8  53.34,34.29 270 top
TP9  64.77,29.21 0 top
TP10  64.77,26.67 180 top
TP11  20.32,30.48 0 top
TP12  33.02,30.48 0 top
TP13  20.32,22.86 0 top
TP14  33.02,22.86 0 top
TP15  7.62,7.62 90 top
TP16  16.51,7.62 90 top
TP17  25.4,7.62 90 top
TP18  40.64,27.94 0 top
TP19  45.72,27.94 0 top
TP20  40.64,24.13 0 top
TP21  45.72,24.13 0 top
TP22  40.64,20.32 0 top
TP23  45.72,20.32 0 top
U$1  44.45,15.24 0 top
U$2  46.99,5.08 0 top
U$3  62.23,16.51 0 top
U$4  38.1,13.97 180 top
U$5  50.8,16.51 0 top

### Tracks (layer width: path | path; a pad name or v marks a point on that pad's centre or on a via)
!CS_ADC1  (1 unrouted)
!CS_ADC2  (1 unrouted)
!CS_DAC  (1 unrouted)
AGND  (9 unrouted)
ANGD  (6 unrouted)
AVDD  (5 unrouted)
BASELINE  (1 unrouted)
CAP_PRECHAR  (1 unrouted)
CLK  (2 unrouted)
CLK_ADC  (2 unrouted)
CLK_DAC  (1 unrouted)
CLK_PRECH1  (2 unrouted)
CLK_PRECH1_T  (1 unrouted)
CLK_PRECH2  (2 unrouted)
CLK_PRECH2_T  (1 unrouted)
CLK_REF  (3 unrouted)
CLK_T  (1 unrouted)
CS_B0  (2 unrouted)
CS_B0_T  (1 unrouted)
CS_B1  (2 unrouted)
CS_B1_T  (1 unrouted)
CS_B2  (2 unrouted)
CS_B2_T  (1 unrouted)
CS_B3  (2 unrouted)
CS_B3_T  (1 unrouted)
CS_B4  (2 unrouted)
CS_B4_T  (1 unrouted)
CS_B5  (2 unrouted)
CS_B5_T  (1 unrouted)
CS_REF_1  (1 unrouted)
CS_REF_2  (1 unrouted)
CS_REF_3  (1 unrouted)
DGND  (5 unrouted)
DVDD  (5 unrouted)
GND  (74 unrouted)
  pour Route3 (isolate 0.305): 0,52.07 71.12,52.07 71.12,0 0,0
GND_DREF  (1 unrouted)
HOLD  (2 unrouted)
HOLD_T  (1 unrouted)
MUX_DAC_EN  (1 unrouted)
MUX_DAC_SEL  (1 unrouted)
MUX_REF_1  (1 unrouted)
MUX_REF_2  (1 unrouted)
MUX_REF_3  (1 unrouted)
N$1  (2 unrouted)
N$2  (2 unrouted)
N$5  (1 unrouted)
N$10  (1 unrouted)
N$17  (1 unrouted)
N$18  (1 unrouted)
N$19  (1 unrouted)
N$28  (1 unrouted)
OP_MODE  (2 unrouted)
OP_MODE_T  (1 unrouted)
OUT_S  (2 unrouted)
OUT_S_T  (1 unrouted)
REF_ADC  (8 unrouted)
REFIN_DAC  (2 unrouted)
RES_BIAS_EXT  (1 unrouted)
RST  (2 unrouted)
RST_CSA  (2 unrouted)
RST_CSA_T  (1 unrouted)
RST_T  (1 unrouted)
SDI_DAC  (1 unrouted)
SDI_REF  (3 unrouted)
SDO_ADC1  (1 unrouted)
SDO_ADC2  (1 unrouted)
SGN  (2 unrouted)
SGN_T  (1 unrouted)
V0NDAC  (1 unrouted)
V0PDAC  (1 unrouted)
V1NDAC  (1 unrouted)
V1PDAC  (1 unrouted)
V_REF_PRECHAR  (5 unrouted)
VCC  (3 unrouted)
VDD  (34 unrouted)
  pour Route2 (isolate 0.305): 0,52.07 71.12,52.07 71.12,0 0,0
VDD2  (7 unrouted)
VDD_REF_1  (3 unrouted)
VDD_REF_2  (3 unrouted)
VDD_REF_3  (3 unrouted)
VDD_SUPPLY_1  (2 unrouted)
VDD_SUPPLY_2  (2 unrouted)
VDD_SUPPLY_IN_1  (5 unrouted)
VDD_SUPPLY_IN_2  (2 unrouted)
VI+_FIL  (2 unrouted)
VI-_FIL  (1 unrouted)
VICM  (9 unrouted)
VICM_MUX  (2 unrouted)
VIN_CSA  (2 unrouted)
VL_ADC  (8 unrouted)
VO+_BP_FIL  (1 unrouted)
VO+_CH  (1 unrouted)
VO+_FIL  (1 unrouted)
VO-_BP_FIL  (1 unrouted)
VO-_CH  (1 unrouted)
VO-_FIL  (1 unrouted)
VOCM  (5 unrouted)
VOCM_1  (1 unrouted)
VOCM_MUX  (2 unrouted)
VOUT_CSA  (1 unrouted)
VU  (3 unrouted)